# EAGLE design nunchuck v0.4 (EAGLE 7.1.0)
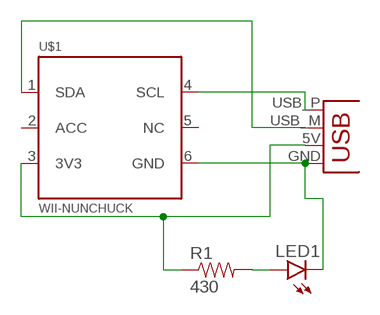
[diagram p0: schematic, sheet 1]

## Parts
JP1  USBPCB  [USB-A-PCB]
LED1  LED0603  [LED-0603]
R1  430  RESISTOR0603  [0603-RES]
U$1  WII-NUNCHUCK  [WII_6PIN]

## Nets
N$1: JP1.GND LED1.C U$1.6(GND)
N$2: JP1.5V(VBUS) R1.1 U$1.3(3V3)
N$3: JP1.USB_M(D-) U$1.1(SDA)
N$4: JP1.USB_P(D+) U$1.4(SCL)
N$5: LED1.A R1.2
Unconnected: U$1.2(ACC) U$1.5(NC)

## Library data of the parts
JP1 = SparkFun-Connectors:USB: USB Connectors USB-B-PTH is fully proven SKU : PRT-00139/CONN-08278 USB-miniB is fully proven SKU : PRT-00587 USB-A-PCB is untested. USB-A-H is throughly reviewed, but untested. Spark Fun Electronics SKU : PRT-00437 USB-B-SMT is throughly reviewed, but untested. Needs silkscreen touching up. USB-A-S has not been used/tested USB-MB-H has not been used/tested USB-MICROB has been used. CONN-09505
LED1 = SparkFun-LED:LED: LEDs Standard schematic elements and footprints for 5mm, 3mm, 1206, and 0603 sized LEDs. 5mm - Spark Fun Electronics SKU : COM-00529 (and others)
R1 = SparkFun-Resistors:RESISTOR: Resistor Basic schematic elements and footprints for 0603, 1206, and PTH resistors.
U$1 = SparkFun-Connectors:WII-NUNCHUCK

## Board
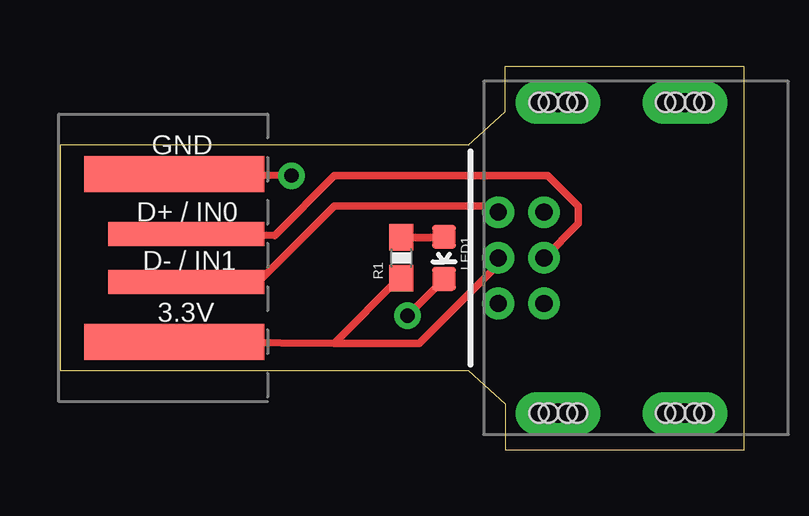
[diagram p1: board, top side]
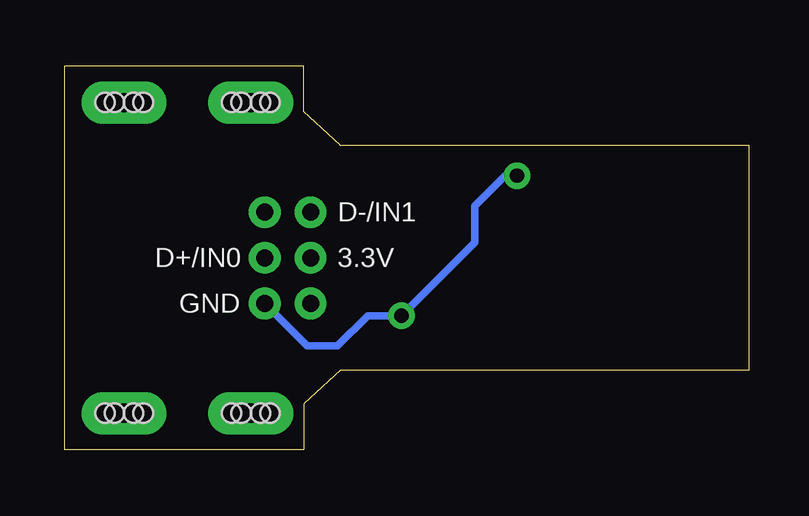
[diagram p2: board, bottom side, seen from below]

Size 28.51 x 16 mm. Coordinates in mm from the lower left corner, seen from the top.
Outline: 17.04,12.7 17.02,12.7
Outline: 17.02,12.7 0,12.7 0,3.3 17.02,3.3 18.54,1.91 18.54,0 28.51,0 28.51,16 18.54,16 18.54,14.1 17.02,12.7
Copper layers (1*16): Top 0.035mm / dielectric 1.5mm / Bottom 0.035mm
Design rules "SparkFun": minimum track width 8mil, minimum drill 20mil, track to track 8mil, track to pad 8mil, pad to pad 8mil, via to via 8mil, smd to smd 8mil, copper to edge 10mil, drill to drill 8mil, minimum pad ring 12mil, minimum via ring 10mil, stop-mask expansion 4mil, vias tented up to drill 25mil, thermal gap 10mil

### Footprints (pad centres in the part's own frame; a part is rotated, then mirrored left to right if it is on the bottom)
USB-A-PCB = smd 7.5 x 1.5: 5V -0.2,-3.5; GND -0.2,3.5 | smd 6.5 x 1: USB_M 0.3,-1; USB_P 0.3,1
LED-0603 = smd 1 x 1: A 0,-0.877; C 0,0.877
0603-RES = smd 1.1 x 1: 1 -0.85,0; 2 0.85,0
WII_6PIN = drill 0.711: 1 -1.905,-5.74; 2 -1.905,-3.835; 3 0,-5.74; 4 0,-3.835; 5 1.905,-5.74; 6 1.905,-3.835 | drill 0.8 pad 1.778 long: P$7 -6.477,-3.251; P$8 -6.477,2.032; P$9 6.477,2.032; P$10 6.477,-3.251 | hole 0.8: -6.477,1.632; -6.477,1.232; -6.477,2.432; -6.477,2.832; 6.477,1.632; 6.477,1.232; 6.477,2.432; 6.477,2.832; 6.477,-3.651; 6.477,-4.051; 6.477,-2.851; 6.477,-2.451; -6.477,-3.651; -6.477,-4.051; -6.477,-2.851; -6.477,-2.451

### Placement (x,y rotation side)
JP1  4.95,8 0 top
LED1  16,8 180 top
R1  14.22,8 90 top
U$1  24,8 270 top

### Tracks (layer width: path | path; a pad name or v marks a point on that pad's centre or on a via)
N$1  (via drill 0.6)
  Top 0.305: LED1.C v14.48,5.59 | JP1.GND v9.64,11.44 v9.65,11.43
  Bottom 0.305: U$1.6 18.39,4.32 17.14,4.32 15.88,5.59 v14.48,5.59 11.43,8.64 11.43,10.16 10.16,11.43 v9.65,11.43
N$2
  Top 0.305: U$1.3 18.26,7.72 14.98,4.44 11.43,4.44 | JP1.5V 11.43,4.44 | R1.1 14.14,7.15 11.43,4.44
N$3
  Top 0.305: JP1.USB_M 8.21,6.94 11.43,10.16 18.01,10.16 U$1.1
N$4
  Top 0.305: JP1.USB_P 8.94,8.94 11.43,11.43 20.32,11.43 21.59,10.16 21.59,9.42 U$1.4
N$5
  Top 0.305: R1.2 15.97,8.85 LED1.A

### Text on the board
tNames: GND | D+ / IN0 | D- / IN1 | 3.3V
bNames: D-/IN1 | 3.3V | D+/IN0 | GND